# Altium schematic sheet 21_RESET_MISC.SchDoc
size A3; DocumentNumber: 21; SheetNumber: 21; SheetTotal: 21
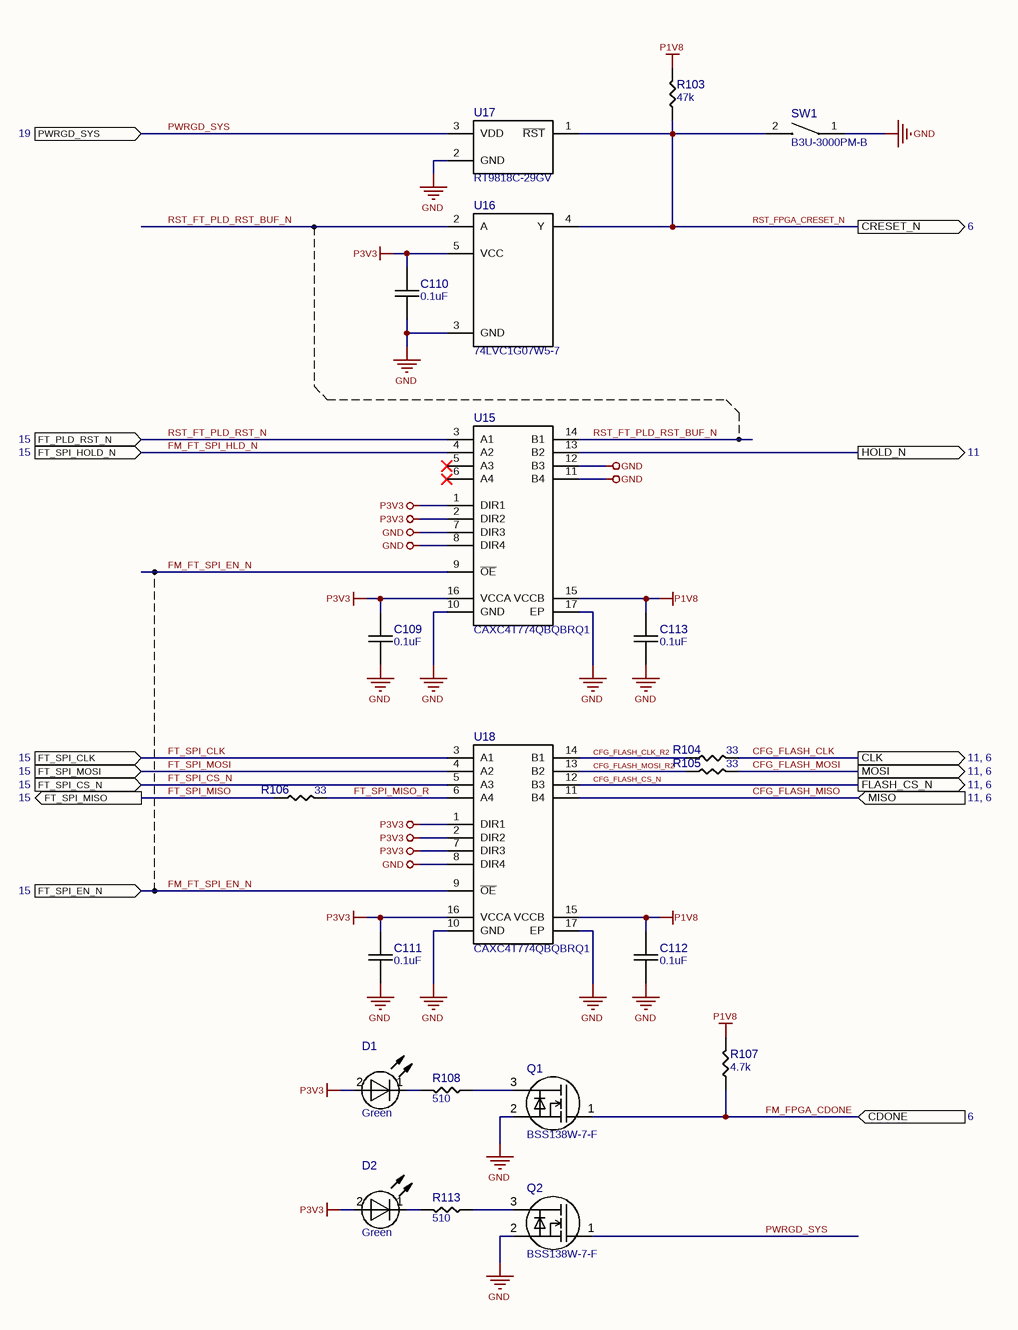
[diagram p0: 21_RESET_MISC.SchDoc]

## Parts
C109  0.1uF  [CAPC1005X06N]
C110  0.1uF  [CAPC1005X06N]
C111  0.1uF  [CAPC1005X06N]
C112  0.1uF  [CAPC1005X06N]
C113  0.1uF  [CAPC1005X06N]
D1  Green  [LED1608]
D2  Green  [LED1608]
Q1  BSS138W-7-F  [SOT65P205X100-3N]
Q2  BSS138W-7-F  [SOT65P205X100-3N]
R103  47k  [RESC1005X03N]
R104  33  [RESC1005X03N]
R105  33  [RESC1005X03N]
R106  33  [RESC1005X03N]
R107  4.7k  [RESC1005X03N]
R108  510  [RESC1005X03N]
R113  510  [RESC1005X03N]
SW1  B3U-3000PM-B  [B3U-3000P(M)-B]
U15  CAXC4T774QBQBRQ1
U16  74LVC1G07W5-7  [SOT95P280X145-5N]
U17  RT9818C-29GV  [SOT95P230X110-3N]
U18  CAXC4T774QBQBRQ1

## Ports
CDONE (in, see 6), CLK (out, see 11, 6), CRESET_N (out, see 6), FLASH_CS_N (out, see 11, 6), FT_PLD_RST_N (in, see 15), FT_SPI_CLK (in, see 15), FT_SPI_CS_N (in, see 15), FT_SPI_EN_N (in, see 15), FT_SPI_HOLD_N (in, see 15), FT_SPI_MISO (out, see 15), FT_SPI_MOSI (in, see 15), HOLD_N (out, see 11), MISO (in, see 11, 6), MOSI (out, see 11, 6), PWRGD_SYS (in, see 19)

## Nets
GND: C109.1 C110.1 C111.1 C112.1 C113.1 Q1.2(S) Q2.2(S) SW1.1 U15.7(DIR3) U15.8(DIR4) U15.10(GND) U15.11(B4) U15.12(B3) U15.17(EP) U16.3(GND) U17.2(GND) U18.8(DIR4) U18.10(GND) U18.17(EP)
P1V8: C112.2 C113.2 R103.2 R107.2 U15.15(VCCB) U18.15(VCCB)
P3V3: C109.2 C110.2 C111.2 D1.2(A) D2.2(A) U15.1(DIR1) U15.2(DIR2) U15.16(VCCA) U16.5(VCC) U18.1(DIR1) U18.2(DIR2) U18.7(DIR3) U18.16(VCCA)
CFG_FLASH_CLK: R104.2 ; port CLK
CFG_FLASH_CLK_R2: R104.1 U18.14(B1)
CFG_FLASH_CS_N: U18.12(B3) ; port FLASH_CS_N
CFG_FLASH_MISO: U18.11(B4) ; port MISO
CFG_FLASH_MOSI: R105.2 ; port MOSI
CFG_FLASH_MOSI_R2: R105.1 U18.13(B2)
FM_FPGA_CDONE: Q1.1(G) R107.1 ; port CDONE
FM_FT_SPI_EN_N: U15.9(~{OE}) U18.9(~{OE}) ; port FT_SPI_EN_N
FM_FT_SPI_HLD_N: U15.4(A2) ; port FT_SPI_HOLD_N
FT_SPI_CLK: U18.3(A1) ; port FT_SPI_CLK
FT_SPI_CS_N: U18.5(A3) ; port FT_SPI_CS_N
FT_SPI_MISO: R106.1 ; port FT_SPI_MISO
FT_SPI_MISO_R: R106.2 U18.6(A4)
FT_SPI_MOSI: U18.4(A2) ; port FT_SPI_MOSI
HOLD_N: U15.13(B2) ; port HOLD_N
PWRGD_SYS: Q2.1(G) U17.3(VDD) ; port PWRGD_SYS
RST_FPGA_CRESET_N: R103.1 SW1.2 U16.4(Y) U17.1(~{RST}) ; port CRESET_N
RST_FT_PLD_RST_BUF_N: U15.14(B1) U16.2(A)
RST_FT_PLD_RST_N: U15.3(A1) ; port FT_PLD_RST_N
NetD1_1: D1.1(C) R108.2
NetD2_1: D2.1(C) R113.2
NetQ1_3: Q1.3(D) R108.1
NetQ2_3: Q2.3(D) R113.1

Not connected (* = marked no-connect by the designer): U15 5(A3)* 6(A4)*

## Library data of the parts
C109-C113 = GRM155R71E104KE14J: CAP CER 0.1UF 25V X7R 0402; Manufacturer 1: Murata Electronics; Tol: 10%; Part Number: GRM155R71E104KE14J; Value: 0.1uF; Voltage: 25V; TempC: X7R; Manufacturer Part Number 1: GRM155R71E104KE14J; Supplier 1: Digi-Key; Supplier Part Number 1: 490-14603-1-ND
D1 D2 = APT1608SGC: LED GREEN CLEAR CHIP SMD; Manufacturer 1: Kingbright; Part Number: APT1608SGC; Manufacturer Part Number 1: APT1608SGC; Supplier 1: Digi-Key; Supplier Part Number 1: 754-1121-1-ND
Q1 Q2 = BSS138W-7-F: MOSFET N-CH 50V 200MA SOT323; Manufacturer 1: Diodes Incorporated; Part Number: BSS138W-7-F; Manufacturer Part Number 1: BSS138W-7-F; Supplier 1: Digi-Key; Supplier Part Number 1: BSS138W-FDICT-ND
R103 = RC0402FR-0747KL: RES SMD 47K OHM 1% 1/16W 0402; Manufacturer 1: Yageo; Part Number: RC0402FR-0747KL; Value: 47k; Tol: 1%; Manufacturer Part Number 1: RC0402FR-0747KL; Supplier 1: Digi-Key; Supplier Part Number 1: 311-47.0KLRCT-ND
R104-R106 = RC0402FR-0733RL: RES SMD 33 OHM 1% 1/16W 0402; Manufacturer 1: Yageo; Part Number: RC0402FR-0733RL; Value: 33; Tol: 1%; Manufacturer Part Number 1: RC0402FR-0733RL; Supplier 1: Digi-Key; Supplier Part Number 1: 311-33.0LRCT-ND
R107 = RC0402FR-074K7L: RES SMD 4.7K OHM 1% 1/16W 0402; Manufacturer 1: Yageo; Part Number: RC0402FR-074K7L; Value: 4.7k; Tol: 1%; Manufacturer Part Number 1: RC0402FR-074K7L; Supplier 1: Digi-Key; Supplier Part Number 1: 311-4.7KLRCT-ND
R108 R113 = RC0402JR-07510RL: RES 510 OHM 5% 1/16W 0402; Manufacturer 1: Yageo; Tol: 1%; Part Number: RC0402JR-07510RL; Value: 510; Manufacturer Part Number 1: RC0402JR-07510RL; Supplier 1: Digi-Key; Supplier Part Number 1: 311-510JRCT-ND
SW1 = B3U-3000PM-B: SWITCH TACTILE SPST-NO 0.05A 12V; Manufacturer 1: Omron Electronics Inc-EMC Div; Part Number: B3U-3000PM-B; Manufacturer Part Number 1: B3U-3000PM-B; Supplier 1: Digi-Key; Supplier Part Number 1: Z8276CT-ND
U15 U18 = CAXC4T774QBQBRQ1: AUTOMOTIVE 4-BIT 2-SUPPLY BUS TR; Manufacturer 1: Texas Instruments; Part Number: CAXC4T774QBQBRQ1; Manufacturer Part Number 1: CAXC4T774QBQBRQ1; Supplier 1: Digi-Key; Supplier Part Number 1: 296-CAXC4T774QBQBRQ1CT-ND
U16 = 74LVC1G07W5-7: IC BUFFER NON-INVERT 5.5V SOT25; Manufacturer 1: Diodes Incorporated; Part Number: 74LVC1G07W5-7; Manufacturer Part Number 1: 74LVC1G07W5-7; Supplier 1: Digi-Key; Supplier Part Number 1: 74LVC1G07W5-7DICT-ND
U17 = RT9818C-29GV: IC SUPERVISOR 1 CHANNEL SOT23-3; Manufacturer 1: Richtek USA Inc.; Part Number: RT9818C-29GV; Manufacturer Part Number 1: RT9818C-29GV; Supplier 1: Digi-Key; Supplier Part Number 1: 1028-1020-1-ND